# EAGLE design uv_brick (EAGLE 7.2.0)
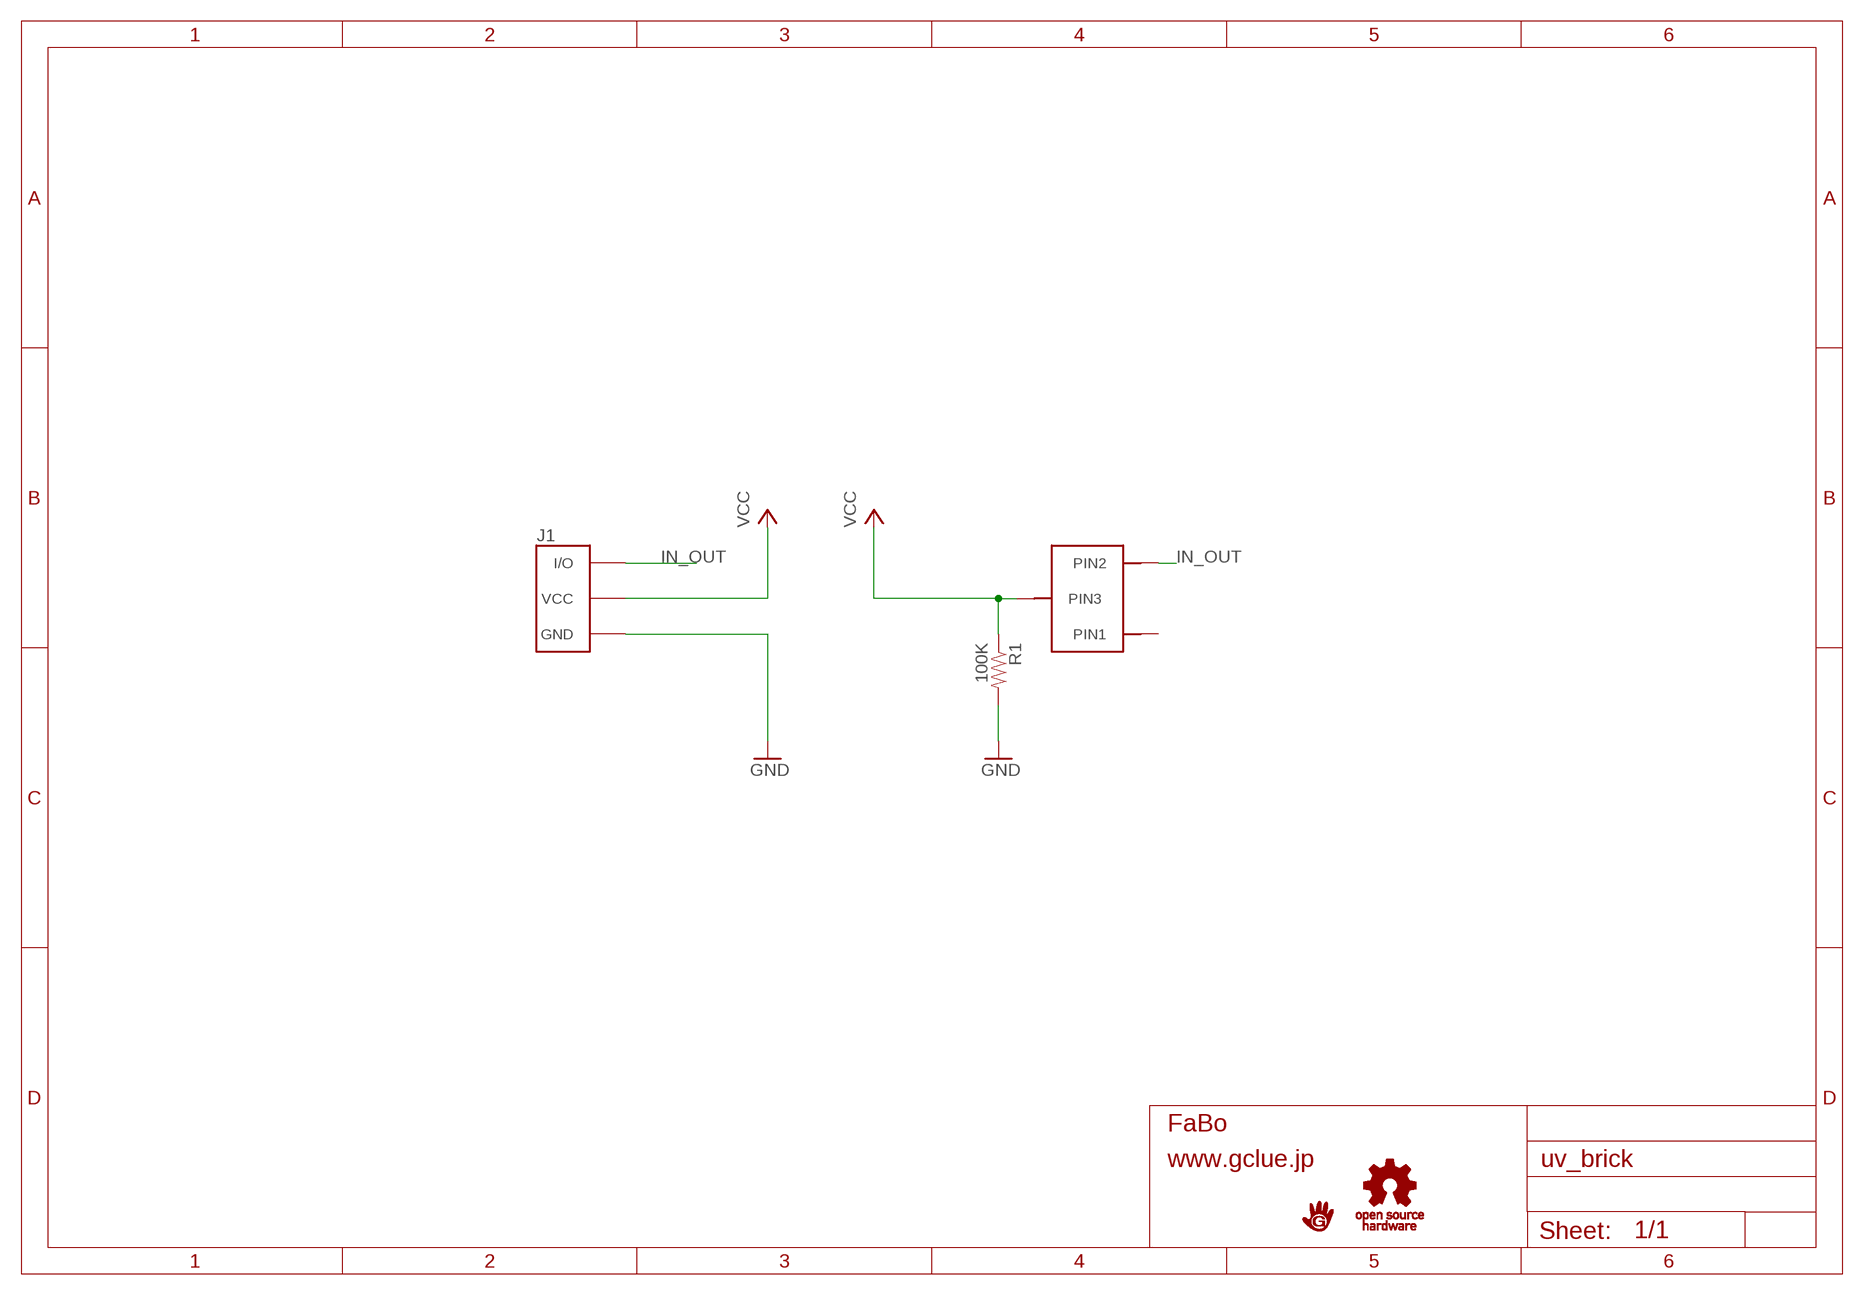
[diagram p0: schematic, sheet 1]

## Parts
J1  BRICK_3PIN  [BRICK_3PIN]
R1  100K  RESISTOR0603-RES  [0603-RES]
U$1  GAASP-G6262  [GAASP-G6262]
U$3  LOGO_GCLUE-M  [LOGO_GCLUE_M]
U$4  LOGO_OSHW_T-M  [LOGO_OSHW_T_M]

## Nets
GND: J1.GND R1.2
IN_OUT: J1.IN/OUT(I/O) U$1.2(PIN2)
VCC: J1.VCC R1.1 U$1.3(PIN3)
Unconnected: U$1.1(PIN1)

## Library data of the parts
J1 = gclue:BRICK_3PIN: FaBo Brick 3pin
R1 = SparkFun:RESISTOR: Resistor Basic schematic elements and footprints for 0603, 1206, and PTH resistors.
U$1 = gclue:GAASP-G6262
U$3 = gclue:LOGO_GCLUE
U$4 = gclue:LOGO_OSHW_T

## Board
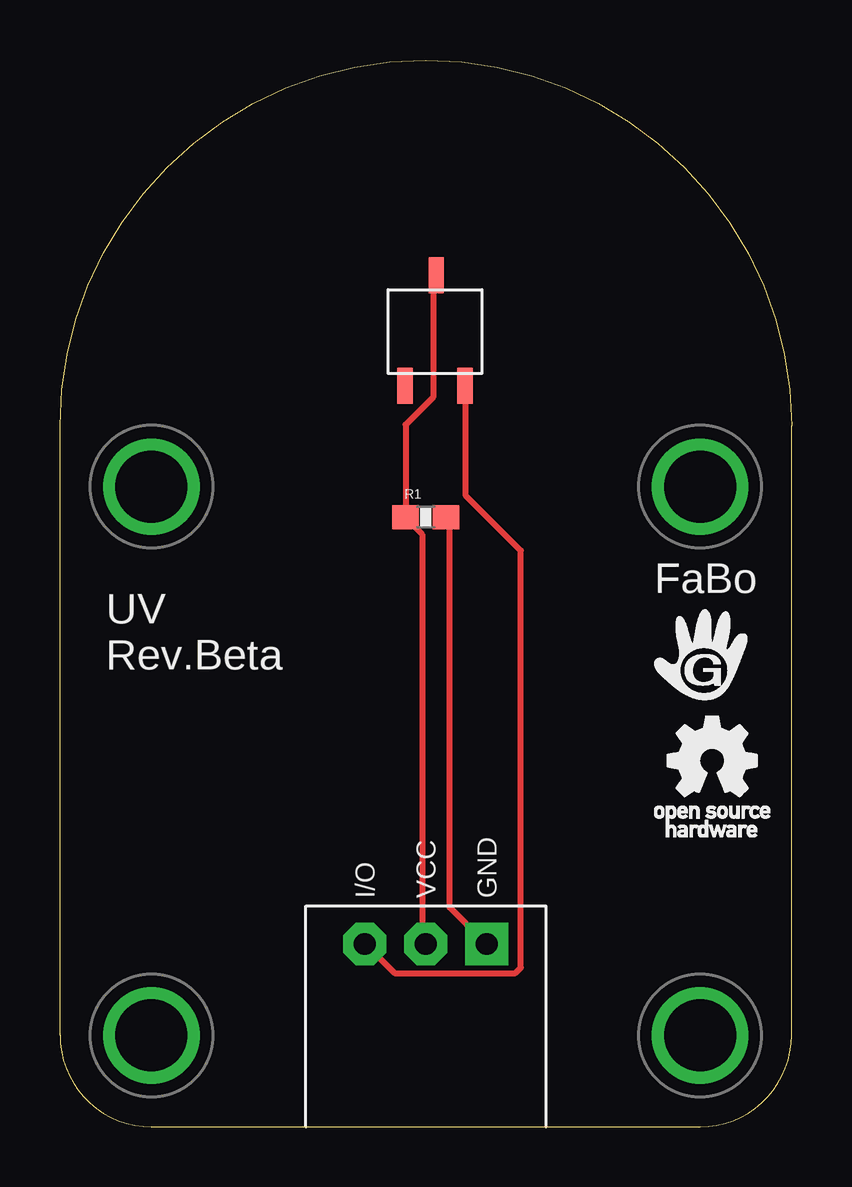
[diagram p1: board, top side]
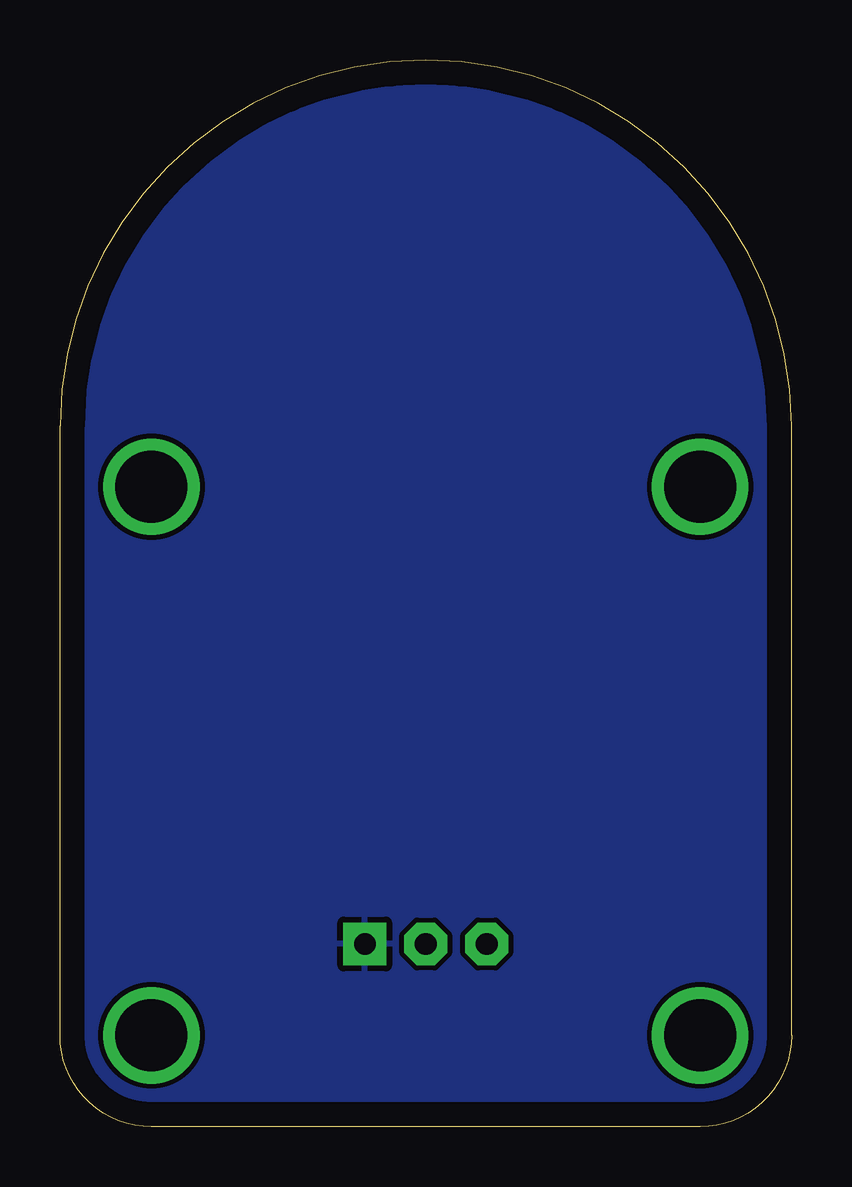
[diagram p2: board, bottom side, seen from below]

Size 30.48 x 44.45 mm. Coordinates in mm from the lower left corner, seen from the top.
Copper layers (1*16): Top 0.035mm / dielectric 1.5mm / Bottom 0.035mm
Design rules "default": minimum track width 10mil, minimum drill 24mil, track to track 8mil, track to pad 8mil, pad to pad 8mil, via to via 8mil, smd to smd 8mil, copper to edge 40mil, drill to drill 8mil, minimum pad ring 10mil, minimum via ring 8mil, stop-mask expansion 4mil, vias tented up to drill 0mil, thermal gap 10mil

### Footprints (pad centres in the part's own frame; a part is rotated, then mirrored left to right if it is on the bottom)
BRICK_3PIN = drill 0.9 pad 1.778 square: GND 2.54,-11.43 | drill 0.9 pad 1.778 octagon: IN/OUT -2.54,-11.43; VCC 0,-11.43 | drill 3 pad 3.81: P$1 -11.43,7.62; P$2 11.43,7.62; P$3 11.43,-15.24; P$4 -11.43,-15.24
0603-RES = smd 1.1 x 1: 1 -0.85,0; 2 0.85,0
GAASP-G6262 = smd 0.635 x 1.5: 1 -1.5,-1.5; 2 1,-1.5; 3 -0.2,3.1

### Placement (x,y rotation side)
J1  15.24,19.05 0 top
R1  15.24,25.4 0 top
U$1  15.88,32.38 0 top
U$3  26.67,19.68 0 top
U$4  27.3,14.61 0 top

### Tracks (layer width: path | path; a pad name or v marks a point on that pad's centre or on a via)
GND
  Top 0.254: R1.2 16.23,25.38 16.23,9.14 17.6,7.77 J1.GND
  pour Bottom: 0,0 31.11,0 30.48,45.72 -0.64,44.45
IN_OUT
  Top 0.254: U$1.2 16.92,30.86 16.92,26.29 19.2,24 19.2,6.63 18.97,6.4 13.95,6.4 12.8,7.54 J1.IN/OUT
VCC
  Top 0.254: U$1.3 15.54,35.43 15.54,30.4 14.4,29.26 14.4,25.6 R1.1 14.4,25.38 15.09,24.69 15.09,7.77 J1.VCC

### Text on the board
tPlace: FaBo | UV / Rev.Beta